# Altium project PCB_Project.PrjPcb
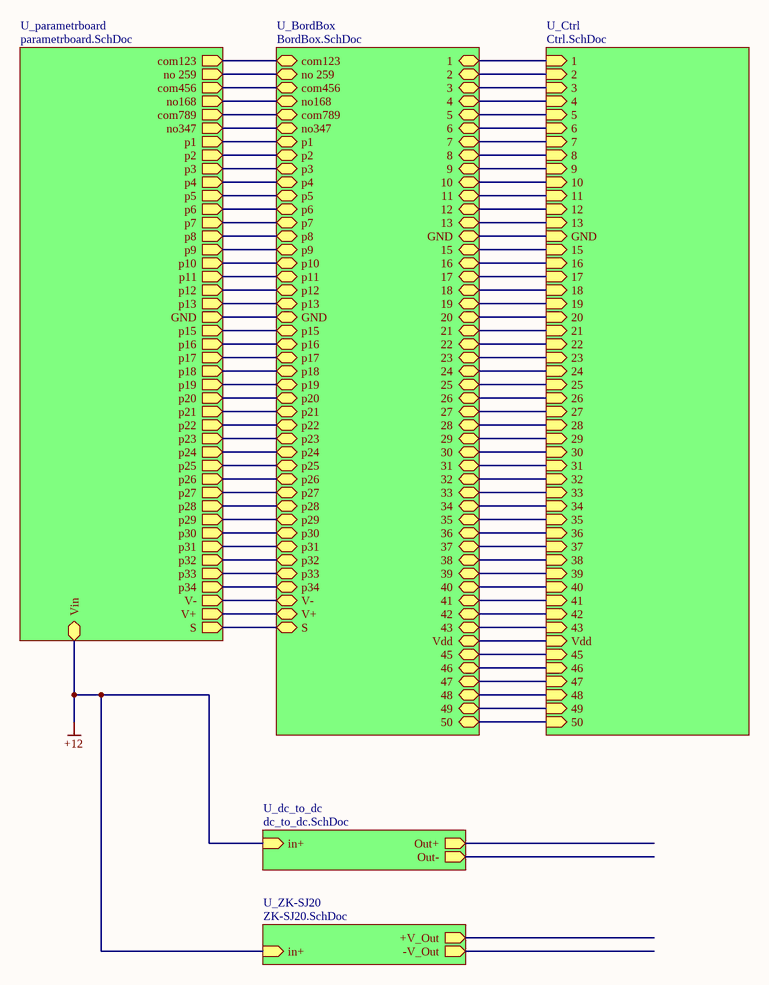
[diagram p0: finetunebox.SchDoc]
6 sheets, 29 parts. Net scope: hierarchical (ports join the sheet entries above them; power ports are global).
Board files: Ctrl.PcbDoc, BoardBox.PcbDoc
Sheets:
  finetunebox.SchDoc
    U_parametrboard = parametrboard.SchDoc
    U_BordBox = BordBox.SchDoc
    U_Ctrl = Ctrl.SchDoc
    U_ZK-SJ20 = ZK-SJ20.SchDoc
    U_dc_to_dc = dc_to_dc.SchDoc

## Sheet finetunebox.SchDoc
size A; SheetNumber: 1; SheetTotal: 6

### Sub-sheets
U_BordBox = BordBox.SchDoc: com123 (bidir), no 259 (bidir), com456 (bidir), no168 (bidir), com789 (bidir), no347 (bidir), p1 (bidir), p2 (bidir), p3 (bidir), p4 (bidir), p5 (bidir), p6 (bidir), p7 (bidir), p8 (bidir), p9 (bidir), p34 (bidir), p33 (bidir), p32 (bidir), p31 (bidir), p30 (bidir), p29 (bidir), p28 (bidir), p27 (bidir), p26 (bidir), p25 (bidir), p24 (bidir), p23 (bidir), p22 (bidir), p21 (bidir), p20 (bidir), p19 (bidir), p18 (bidir), V- (bidir), V+ (bidir), S (bidir), p10 (bidir), p11 (bidir), p12 (bidir), p13 (bidir), p15 (bidir), p16 (bidir), p17 (bidir), 2 (bidir), 1 (bidir), 3 (bidir), 4 (bidir), 5 (bidir), 6 (bidir), 7 (bidir), 8 (bidir), 9 (bidir), 10 (bidir), 11 (bidir), 12 (bidir), 13 (bidir), 15 (bidir), 16 (bidir), 17 (bidir), 18 (bidir), 19 (bidir), 20 (bidir), 21 (bidir), 22 (bidir), 23 (bidir), 24 (bidir), 25 (bidir), 26 (bidir), 27 (bidir), 28 (bidir), 29 (bidir), 30 (bidir), 31 (bidir), 32 (bidir), 33 (bidir), 34 (bidir), 35 (bidir), 36 (bidir), 37 (bidir), 38 (bidir), 39 (bidir), 40 (bidir), 41 (bidir), 42 (bidir), 43 (bidir), 46 (bidir), 47 (bidir), 48 (bidir), 49 (bidir), 50 (bidir), Vdd (bidir), GND (bidir), 45 (bidir), GND (bidir)
U_Ctrl = Ctrl.SchDoc: 1 (in), 2 (in), 3 (in), 4 (in), 5 (in), 6 (in), 7 (in), 8 (in), 9 (in), 10 (in), 11 (in), 12 (in), 13 (in), 15 (in), 16 (in), 17 (in), 18 (in), 19 (in), 20 (in), 21 (in), 22 (in), 23 (in), 24 (in), 25 (in), 26 (in), 27 (in), 28 (in), 29 (in), 30 (in), 31 (in), 32 (in), 33 (in), 34 (in), 46 (in), 47 (in), 48 (in), 49 (in), 50 (in), 35 (in), 36 (in), 37 (in), 38 (in), 39 (in), 40 (in), 41 (in), 42 (in), 43 (in), Vdd (in), GND (in), 45 (in)
U_dc_to_dc = dc_to_dc.SchDoc: in+ (in), Out+ (out), Out- (out)
U_parametrboard = parametrboard.SchDoc: com123 (out), no 259 (out), com456 (out), no168 (out), com789 (out), no347 (out), p1 (out), p2 (out), p3 (out), p4 (out), p5 (out), p6 (out), p7 (out), p8 (out), p9 (out), p10 (out), p11 (out), p12 (out), p13 (out), p15 (out), p16 (out), p17 (out), p34 (out), p33 (out), p32 (out), p31 (out), p30 (out), p29 (out), p28 (out), p27 (out), p26 (out), p25 (out), p24 (out), p23 (out), p22 (out), p21 (out), p20 (out), p19 (out), p18 (out), V- (out), V+ (out), S (out), Vin (bidir), GND (out)
U_ZK-SJ20 = ZK-SJ20.SchDoc: +V_Out (out), -V_Out (out), in+ (in)

### Nets
+12: sheet U_parametrboard/Vin, sheet U_ZK-SJ20/in+, sheet U_dc_to_dc/in+
1: sheet U_parametrboard/p1, sheet U_BordBox/p1, sheet U_BordBox/1, sheet U_Ctrl/1
2: sheet U_parametrboard/p2, sheet U_BordBox/p2, sheet U_BordBox/2, sheet U_Ctrl/2
3: sheet U_parametrboard/p3, sheet U_BordBox/p3, sheet U_BordBox/3, sheet U_Ctrl/3
4: sheet U_parametrboard/p4, sheet U_BordBox/p4, sheet U_BordBox/4, sheet U_Ctrl/4
5: sheet U_parametrboard/p5, sheet U_BordBox/p5, sheet U_BordBox/5, sheet U_Ctrl/5
6: sheet U_parametrboard/p6, sheet U_BordBox/p6, sheet U_BordBox/6, sheet U_Ctrl/6
7: sheet U_parametrboard/p7, sheet U_BordBox/p7, sheet U_BordBox/7, sheet U_Ctrl/7
8: sheet U_parametrboard/p8, sheet U_BordBox/p8, sheet U_BordBox/8, sheet U_Ctrl/8
9: sheet U_parametrboard/p9, sheet U_BordBox/p9, sheet U_BordBox/9, sheet U_Ctrl/9
10: sheet U_parametrboard/p10, sheet U_BordBox/p10, sheet U_BordBox/10, sheet U_Ctrl/10
11: sheet U_parametrboard/p11, sheet U_BordBox/p11, sheet U_BordBox/11, sheet U_Ctrl/11
12: sheet U_parametrboard/p12, sheet U_BordBox/p12, sheet U_BordBox/12, sheet U_Ctrl/12
13: sheet U_parametrboard/p13, sheet U_BordBox/p13, sheet U_BordBox/13, sheet U_Ctrl/13
15: sheet U_parametrboard/p15, sheet U_BordBox/p15, sheet U_BordBox/15, sheet U_Ctrl/15
16: sheet U_parametrboard/p16, sheet U_BordBox/p16, sheet U_BordBox/16, sheet U_Ctrl/16
17: sheet U_parametrboard/p17, sheet U_BordBox/p17, sheet U_BordBox/17, sheet U_Ctrl/17
18: sheet U_parametrboard/p18, sheet U_BordBox/p18, sheet U_BordBox/18, sheet U_Ctrl/18
19: sheet U_parametrboard/p19, sheet U_BordBox/p19, sheet U_BordBox/19, sheet U_Ctrl/19
20: sheet U_parametrboard/p20, sheet U_BordBox/p20, sheet U_BordBox/20, sheet U_Ctrl/20
21: sheet U_parametrboard/p21, sheet U_BordBox/p21, sheet U_BordBox/21, sheet U_Ctrl/21
22: sheet U_parametrboard/p22, sheet U_BordBox/p22, sheet U_BordBox/22, sheet U_Ctrl/22
23: sheet U_parametrboard/p23, sheet U_BordBox/p23, sheet U_BordBox/23, sheet U_Ctrl/23
24: sheet U_parametrboard/p24, sheet U_BordBox/p24, sheet U_BordBox/24, sheet U_Ctrl/24
25: sheet U_parametrboard/p25, sheet U_BordBox/p25, sheet U_BordBox/25, sheet U_Ctrl/25
26: sheet U_parametrboard/p26, sheet U_BordBox/p26, sheet U_BordBox/26, sheet U_Ctrl/26
27: sheet U_parametrboard/p27, sheet U_BordBox/p27, sheet U_BordBox/27, sheet U_Ctrl/27
28: sheet U_parametrboard/p28, sheet U_BordBox/p28, sheet U_BordBox/28, sheet U_Ctrl/28
29: sheet U_parametrboard/p29, sheet U_BordBox/p29, sheet U_BordBox/29, sheet U_Ctrl/29
30: sheet U_parametrboard/p30, sheet U_BordBox/p30, sheet U_BordBox/30, sheet U_Ctrl/30
31: sheet U_parametrboard/p31, sheet U_BordBox/p31, sheet U_BordBox/31, sheet U_Ctrl/31
32: sheet U_parametrboard/p32, sheet U_BordBox/p32, sheet U_BordBox/32, sheet U_Ctrl/32
33: sheet U_parametrboard/p33, sheet U_BordBox/p33, sheet U_BordBox/33, sheet U_Ctrl/33
34: sheet U_parametrboard/p34, sheet U_BordBox/p34, sheet U_BordBox/34, sheet U_Ctrl/34
35: sheet U_parametrboard/no347, sheet U_BordBox/no347, sheet U_BordBox/35, sheet U_Ctrl/35
36: sheet U_parametrboard/com789, sheet U_BordBox/com789, sheet U_BordBox/36, sheet U_Ctrl/36
37: sheet U_parametrboard/no168, sheet U_BordBox/no168, sheet U_BordBox/37, sheet U_Ctrl/37
38: sheet U_parametrboard/com456, sheet U_BordBox/com456, sheet U_BordBox/38, sheet U_Ctrl/38
39: sheet U_parametrboard/no 259, sheet U_BordBox/no 259, sheet U_BordBox/39, sheet U_Ctrl/39
40: sheet U_parametrboard/com123, sheet U_BordBox/com123, sheet U_BordBox/40, sheet U_Ctrl/40
41: sheet U_parametrboard/S, sheet U_BordBox/S, sheet U_BordBox/41, sheet U_Ctrl/41
42: sheet U_parametrboard/V+, sheet U_BordBox/V+, sheet U_BordBox/42, sheet U_Ctrl/42
43: sheet U_parametrboard/V-, sheet U_BordBox/V-, sheet U_BordBox/43, sheet U_Ctrl/43
45: sheet U_BordBox/45, sheet U_Ctrl/45
46: sheet U_BordBox/46, sheet U_Ctrl/46
47: sheet U_BordBox/47, sheet U_Ctrl/47
48: sheet U_BordBox/48, sheet U_Ctrl/48
49: sheet U_BordBox/49, sheet U_Ctrl/49
50: sheet U_BordBox/50, sheet U_Ctrl/50
GND: sheet U_parametrboard/GND, sheet U_BordBox/GND, sheet U_BordBox/GND, sheet U_Ctrl/GND
Vdd: sheet U_BordBox/Vdd, sheet U_Ctrl/Vdd

## Sheet parametrboard.SchDoc
size A; SheetNumber: 2; SheetTotal: 6
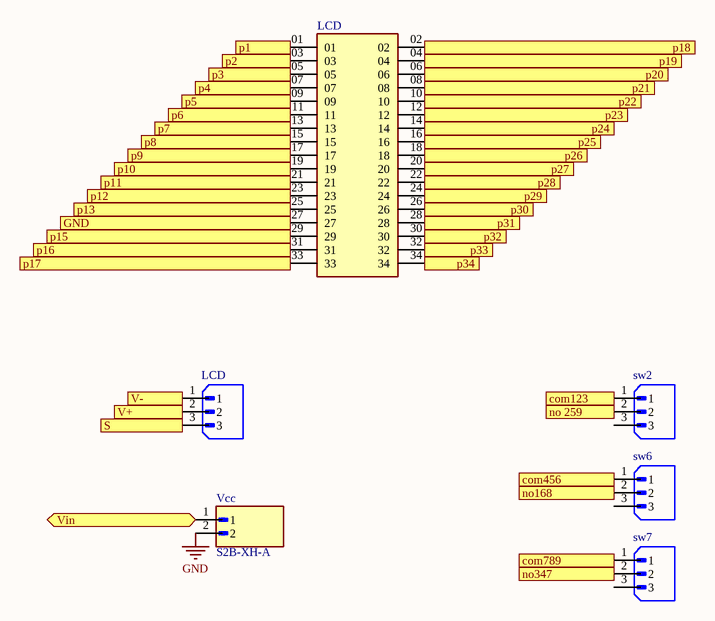
[diagram p1: parametrboard.SchDoc]

### Parts
(Parts that share a designator on the sheet are numbered #1, #2 ... from top to bottom, then left to right.)
LCD#1  TSW-117-23-G-D  [SAMTEC_TSW-117-23-G-D]  (value not drawn)
LCD#2  TSW-117-23-G-D  [SAMTEC_TSW-117-23-G-D]  (value not drawn)
sw2#1  B3B-XH-A  [JST_B3B-XH-A]  (value not drawn)
sw6#1  B3B-XH-A  [JST_B3B-XH-A]  (value not drawn)
sw7#1  B3B-XH-A  [JST_B3B-XH-A]  (value not drawn)
Vcc  S2B-XH-A  [JST_S2B-XH-A]

### Ports
com123 (out, see finetunebox[1A], BordBox[2C]), com456 (out, see finetunebox[1A], BordBox[3C]), com789 (out, see finetunebox[1A], BordBox[4C]), GND (out, see finetunebox[1B], BordBox[1B], BordBox[4B], Ctrl[4A]), no168 (out, see finetunebox[1A], BordBox[3C]), no347 (out, see finetunebox[1A], BordBox[4C]), no 259 (out, see finetunebox[1A], BordBox[2C]), p1 (out, see finetunebox[1A], BordBox[1A]), p2 (out, see finetunebox[1A], BordBox[1A]), p3 (out, see finetunebox[1A], BordBox[1A]), p4 (out, see finetunebox[1A], BordBox[1A]), p5 (out, see finetunebox[1A], BordBox[1A]), p6 (out, see finetunebox[1A], BordBox[1A]), p7 (out, see finetunebox[1A], BordBox[1A]), p8 (out, see finetunebox[1B], BordBox[1A]), p9 (out, see finetunebox[1B], BordBox[1A]), p10 (out, see finetunebox[1B], BordBox[1A]), p11 (out, see finetunebox[1B], BordBox[1B]), p12 (out, see finetunebox[1B], BordBox[1B]), p13 (out, see finetunebox[1B], BordBox[1B]), p15 (out, see finetunebox[1B], BordBox[1B]), p16 (out, see finetunebox[1B], BordBox[1B]), p17 (out, see finetunebox[1B], BordBox[1B]), p18 (out, see finetunebox[1B], BordBox[2A]), p19 (out, see finetunebox[1B], BordBox[2A]), p20 (out, see finetunebox[1B], BordBox[2A]), p21 (out, see finetunebox[1B], BordBox[2A]), p22 (out, see finetunebox[1B], BordBox[2A]), p23 (out, see finetunebox[1B], BordBox[2A]), p24 (out, see finetunebox[1B], BordBox[2A]), p25 (out, see finetunebox[1B], BordBox[2A]), p26 (out, see finetunebox[1B], BordBox[2A]), p27 (out, see finetunebox[1C], BordBox[2A]), p28 (out, see finetunebox[1C], BordBox[2B]), p29 (out, see finetunebox[1C], BordBox[2B]), p30 (out, see finetunebox[1C], BordBox[2B]), p31 (out, see finetunebox[1C], BordBox[2B]), p32 (out, see finetunebox[1C], BordBox[2B]), p33 (out, see finetunebox[1C], BordBox[2B]), p34 (out, see finetunebox[1C], BordBox[2B]), S (out, see finetunebox[1C], BordBox[2D]), V+ (out, see finetunebox[1C], BordBox[2D]), V- (out, see finetunebox[1C], BordBox[2D]), Vin (bidir, see finetunebox[1C])

### Nets
+12: Vcc.1 ; port Vin
GND: Vcc.2
1: LCD#1.01 ; port p1
2: LCD#1.03 ; port p2
3: LCD#1.05 ; port p3
4: LCD#1.07 ; port p4
5: LCD#1.09 ; port p5
6: LCD#1.11 ; port p6
7: LCD#1.13 ; port p7
8: LCD#1.15 ; port p8
9: LCD#1.17 ; port p9
10: LCD#1.19 ; port p10
11: LCD#1.21 ; port p11
12: LCD#1.23 ; port p12
13: LCD#1.25 ; port p13
15: LCD#1.29 ; port p15
16: LCD#1.31 ; port p16
17: LCD#1.33 ; port p17
18: LCD#1.02 ; port p18
19: LCD#1.04 ; port p19
20: LCD#1.06 ; port p20
21: LCD#1.08 ; port p21
22: LCD#1.10 ; port p22
23: LCD#1.12 ; port p23
24: LCD#1.14 ; port p24
25: LCD#1.16 ; port p25
26: LCD#1.18 ; port p26
27: LCD#1.20 ; port p27
28: LCD#1.22 ; port p28
29: LCD#1.24 ; port p29
30: LCD#1.26 ; port p30
31: LCD#1.28 ; port p31
32: LCD#1.30 ; port p32
33: LCD#1.32 ; port p33
34: LCD#1.34 ; port p34
35: sw7#1.2 ; port no347
36: sw7#1.1 ; port com789
37: sw6#1.2 ; port no168
38: sw6#1.1 ; port com456
39: sw2#1.2 ; port no 259
40: sw2#1.1 ; port com123
41: LCD#2.3 ; port S
42: LCD#2.2 ; port V+
43: LCD#2.1 ; port V-
GND: LCD#1.27 ; port GND  [a separate net that carries the same name]

Not connected (* = marked no-connect by the designer): sw2#1 3; sw6#1 3; sw7#1 3

### Library data of the parts
LCD#2 sw2#1 sw6#1 sw7#1 = B3B-XH-A: Connector Header Through Hole 3 position 0.098 (2.50mm); MF: JST Sales; SnapEDA_Link: https://www.snapeda.com/parts/B3B-XH-A/JST+Sales+America+Inc./view-part/?ref=snap; Package: None; Value: *; MP: B3B-XH-A; Check_prices: https://www.snapeda.com/parts/B3B-XH-A/JST+Sales+America+Inc./view-part/?ref=eda
LCD#1 = TSW-117-23-G-D: Package: None; Price: None; Value: *; MP: TSW-117-23-G-D; Availability: Unavailable
Vcc = S2B-XH-A: Package: None; Price: None; Value: *; MP: S2B-XH-A; Availability: Unavailable

## Sheet BordBox.SchDoc
size A; SheetNumber: 5; SheetTotal: 6
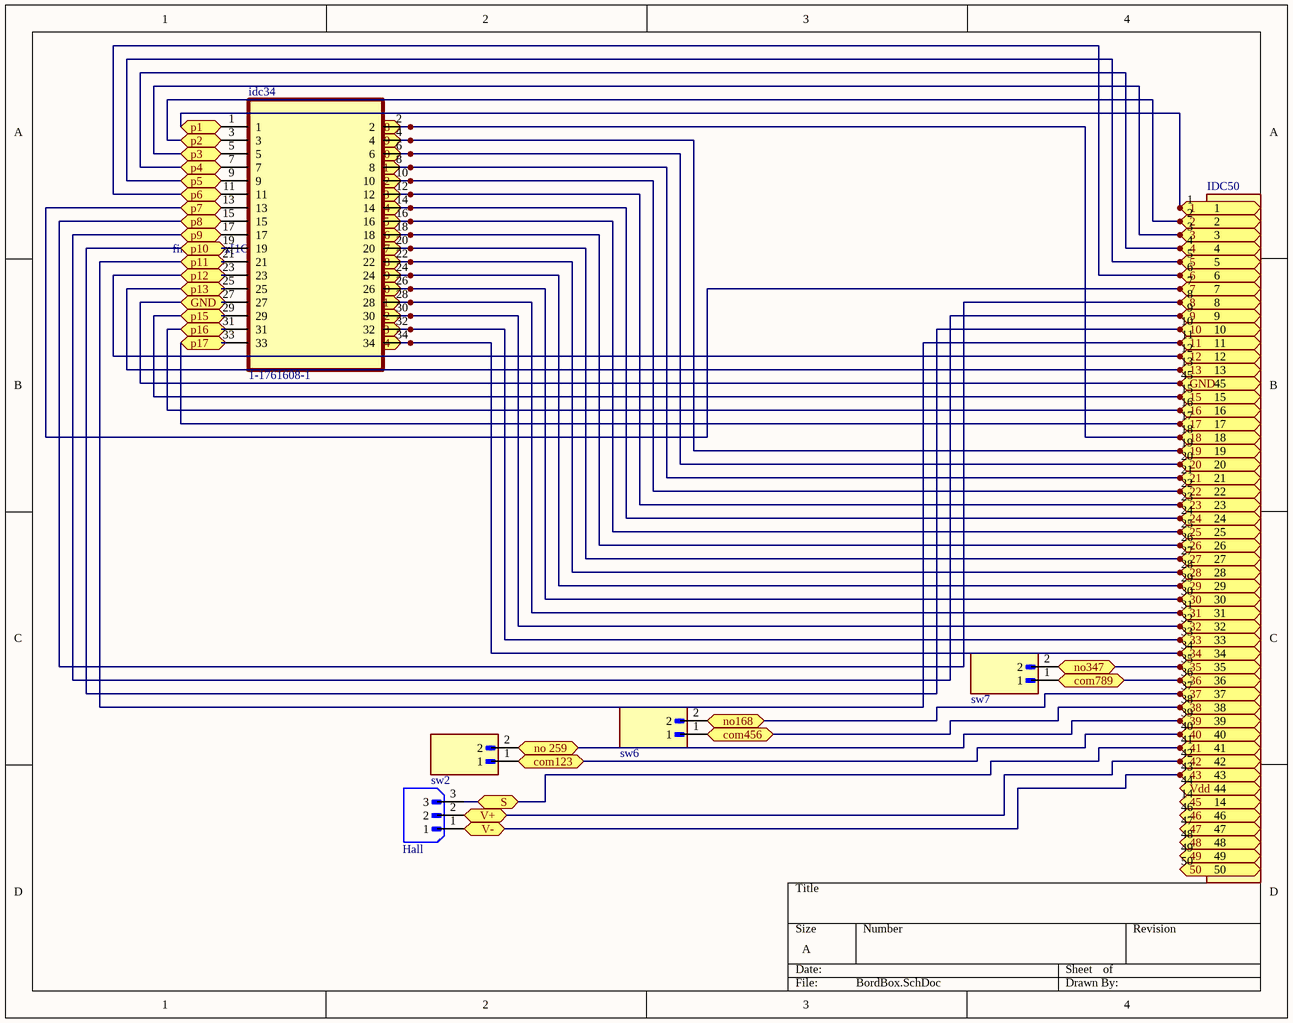
[diagram p2: BordBox.SchDoc]

### Parts
(Parts that share a designator on the sheet are numbered #1, #2 ... from top to bottom, then left to right.)
Hall  B3B-XH-A  [JST_B3B-XH-A]  (value not drawn)
idc34  1-1761608-1  [TYCO_1-1761608-1]
IDC50  1-1761686-5  [TE_1-1761686-5]  (value not drawn)
sw2#2  S2B-XH-A  [JST_S2B-XH-A]  (value not drawn)
sw6#2  S2B-XH-A  [JST_S2B-XH-A]  (value not drawn)
sw7#2  S2B-XH-A  [JST_S2B-XH-A]  (value not drawn)

### Ports
1 (bidir, see finetunebox[2A], Ctrl[4A]), 2 (bidir, see finetunebox[2A], Ctrl[4A]), 3 (bidir, see finetunebox[2A], Ctrl[4A]), 4 (bidir, see finetunebox[2A], Ctrl[4A]), 5 (bidir, see finetunebox[2A], Ctrl[4A]), 6 (bidir, see finetunebox[2A], Ctrl[4A]), 7 (bidir, see finetunebox[2A], Ctrl[4A]), 8 (bidir, see finetunebox[2A], Ctrl[4A]), 9 (bidir, see finetunebox[2A], Ctrl[4A]), 10 (bidir, see finetunebox[2A], Ctrl[4A]), 11 (bidir, see finetunebox[2A], Ctrl[4A]), 12 (bidir, see finetunebox[2A], Ctrl[4A]), 13 (bidir, see finetunebox[2A], Ctrl[4A]), 15 (bidir, see finetunebox[2B], Ctrl[4A]), 16 (bidir, see finetunebox[2B], Ctrl[4A]), 17 (bidir, see finetunebox[2B], Ctrl[4B]), 18 (bidir, see finetunebox[2B], Ctrl[4B]), 19 (bidir, see finetunebox[2B], Ctrl[4B]), 20 (bidir, see finetunebox[2B], Ctrl[4B]), 21 (bidir, see finetunebox[2B], Ctrl[4B]), 22 (bidir, see finetunebox[2B], Ctrl[4B]), 23 (bidir, see finetunebox[2B], Ctrl[4B]), 24 (bidir, see finetunebox[2B], Ctrl[4B]), 25 (bidir, see finetunebox[2B], Ctrl[4B]), 26 (bidir, see finetunebox[2B], Ctrl[4B]), 27 (bidir, see finetunebox[2B], Ctrl[4B]), 28 (bidir, see finetunebox[2B], Ctrl[4B]), 29 (bidir, see finetunebox[2B], Ctrl[4B]), 30 (bidir, see finetunebox[2B], Ctrl[4B]), 31 (bidir, see finetunebox[2B], Ctrl[4B]), 32 (bidir, see finetunebox[2B], Ctrl[4B]), 33 (bidir, see finetunebox[2C], Ctrl[4B]), 34 (bidir, see finetunebox[2C], Ctrl[4B]), 35 (bidir, see finetunebox[2C], Ctrl[3B]), 36 (bidir, see finetunebox[2C], Ctrl[3B]), 37 (bidir, see finetunebox[2C], Ctrl[2B]), 38 (bidir, see finetunebox[2C], Ctrl[2B]), 39 (bidir, see finetunebox[2C], Ctrl[2B]), 40 (bidir, see finetunebox[2C], Ctrl[2C]), 41 (bidir, see finetunebox[2C], Ctrl[2C]), 42 (bidir, see finetunebox[2C], Ctrl[2C]), 43 (bidir, see finetunebox[2C], Ctrl[2D]), 45 (bidir, see finetunebox[2C], Ctrl[3C]), 46 (bidir, see finetunebox[2C], Ctrl[3C]), 47 (bidir, see finetunebox[2C], Ctrl[3C]), 48 (bidir, see finetunebox[2C], Ctrl[3C]), 49 (bidir, see finetunebox[2C], Ctrl[3C]), 50 (bidir, see finetunebox[2C], Ctrl[3C]), com123 (bidir, see finetunebox[1A], parametrboard[3B]), com456 (bidir, see finetunebox[1A], parametrboard[2C]), com789 (bidir, see finetunebox[1A], parametrboard[2C]), GND (bidir, see finetunebox[1B], Ctrl[4A], parametrboard[1B]), no168 (bidir, see finetunebox[1A], parametrboard[2C]), no347 (bidir, see finetunebox[1A], parametrboard[2C]), no 259 (bidir, see finetunebox[1A], parametrboard[3B]), p1 (bidir, see finetunebox[1A], parametrboard[2A]), p2 (bidir, see finetunebox[1A], parametrboard[2A]), p3 (bidir, see finetunebox[1A], parametrboard[2A]), p4 (bidir, see finetunebox[1A], parametrboard[1A]), p5 (bidir, see finetunebox[1A], parametrboard[1A]), p6 (bidir, see finetunebox[1A], parametrboard[1A]), p7 (bidir, see finetunebox[1A], parametrboard[1A]), p8 (bidir, see finetunebox[1B], parametrboard[1A]), p9 (bidir, see finetunebox[1B], parametrboard[1A]), p10 (bidir, see finetunebox[1B], parametrboard[1A]), p11 (bidir, see finetunebox[1B], parametrboard[1A]), p12 (bidir, see finetunebox[1B], parametrboard[1A]), p13 (bidir, see finetunebox[1B], parametrboard[1A]), p15 (bidir, see finetunebox[1B], parametrboard[1B]), p16 (bidir, see finetunebox[1B], parametrboard[1B]), p17 (bidir, see finetunebox[1B], parametrboard[1B]), p18 (bidir, see finetunebox[1B], parametrboard[2A]), p19 (bidir, see finetunebox[1B], parametrboard[2A]), p20 (bidir, see finetunebox[1B], parametrboard[2A]), p21 (bidir, see finetunebox[1B], parametrboard[2A]), p22 (bidir, see finetunebox[1B], parametrboard[2A]), p23 (bidir, see finetunebox[1B], parametrboard[2A]), p24 (bidir, see finetunebox[1B], parametrboard[2A]), p25 (bidir, see finetunebox[1B], parametrboard[2A]), p26 (bidir, see finetunebox[1B], parametrboard[2A]), p27 (bidir, see finetunebox[1C], parametrboard[2A]), p28 (bidir, see finetunebox[1C], parametrboard[2A]), p29 (bidir, see finetunebox[1C], parametrboard[2A]), p30 (bidir, see finetunebox[1C], parametrboard[2A]), p31 (bidir, see finetunebox[1C], parametrboard[2B]), p32 (bidir, see finetunebox[1C], parametrboard[2B]), p33 (bidir, see finetunebox[1C], parametrboard[2B]), p34 (bidir, see finetunebox[1C], parametrboard[2B]), S (bidir, see finetunebox[1C], parametrboard[1B]), V+ (bidir, see finetunebox[1C], parametrboard[1B]), V- (bidir, see finetunebox[1C], parametrboard[1B]), Vdd (bidir, see finetunebox[2C], Ctrl[3C])

### Nets
1: idc34.1 IDC50.1 ; port p1, port 1
2: idc34.3 IDC50.2 ; port p2, port 2
3: idc34.5 IDC50.3 ; port p3, port 3
4: idc34.7 IDC50.4 ; port p4, port 4
5: idc34.9 IDC50.5 ; port p5, port 5
6: idc34.11 IDC50.6 ; port p6, port 6
7: idc34.13 IDC50.7 ; port p7, port 7
8: idc34.15 IDC50.8 ; port p8, port 8
9: idc34.17 IDC50.9 ; port p9, port 9
10: idc34.19 IDC50.10 ; port p10, port 10
11: idc34.21 IDC50.11 ; port p11, port 11
12: idc34.23 IDC50.12 ; port p12, port 12
13: idc34.25 IDC50.13 ; port p13, port 13
15: idc34.29 IDC50.15 ; port p15, port 15
16: idc34.31 IDC50.16 ; port p16, port 16
17: idc34.33 IDC50.17 ; port p17, port 17
18: idc34.2 IDC50.18 ; port p18, port 18
19: idc34.4 IDC50.19 ; port p19, port 19
20: idc34.6 IDC50.20 ; port p20, port 20
21: idc34.8 IDC50.21 ; port p21, port 21
22: idc34.10 IDC50.22 ; port p22, port 22
23: idc34.12 IDC50.23 ; port p23, port 23
24: idc34.14 IDC50.24 ; port p24, port 24
25: idc34.16 IDC50.25 ; port p25, port 25
26: idc34.18 IDC50.26 ; port p26, port 26
27: idc34.20 IDC50.27 ; port p27, port 27
28: idc34.22 IDC50.28 ; port p28, port 28
29: idc34.24 IDC50.29 ; port p29, port 29
30: idc34.26 IDC50.30 ; port p30, port 30
31: idc34.28 IDC50.31 ; port p31, port 31
32: idc34.30 IDC50.32 ; port p32, port 32
33: idc34.32 IDC50.33 ; port p33, port 33
34: idc34.34 IDC50.34 ; port p34, port 34
35: IDC50.35 sw7#2.2 ; port no347, port 35
36: IDC50.36 sw7#2.1 ; port com789, port 36
37: IDC50.37 sw6#2.2 ; port no168, port 37
38: IDC50.38 sw6#2.1 ; port com456, port 38
39: IDC50.39 sw2#2.2 ; port no 259, port 39
40: IDC50.40 sw2#2.1 ; port com123, port 40
41: Hall.3 IDC50.41 ; port S, port 41
42: Hall.2 IDC50.42 ; port V+, port 42
43: Hall.1 IDC50.43 ; port V-, port 43
45: IDC50.14 ; port 45
46: IDC50.46 ; port 46
47: IDC50.47 ; port 47
48: IDC50.48 ; port 48
49: IDC50.49 ; port 49
50: IDC50.50 ; port 50
GND: idc34.27 IDC50.45 ; port GND
Vdd: IDC50.44 ; port Vdd

### Library data of the parts
Hall = B3B-XH-A: as LCD#2 on sheet parametrboard; SnapEDA_Link: https://www.snapeda.com/parts/B3B-XH-A/JST+Sales+America+Inc./view-part/?ref=snap; Package: None; Value: *; MP: B3B-XH-A; Check_prices: https://www.snapeda.com/parts/B3B-XH-A/JST+Sales+America+Inc./view-part/?ref=eda
idc34 = 1-1761608-1: IDC LOW PRO HDR 34P VERT SHT L; MF: TE Connectivity; MP: 117616081; SnapEDA_Link: https://www.snapeda.com/parts/117616081/TE+Connectivity/view-part/?ref=snap; Package: None; Value: *; Check_prices: https://www.snapeda.com/parts/117616081/TE+Connectivity/view-part/?ref=eda
IDC50 = 1-1761686-5: Package: None; Price: None; Value: *; MP: 1-1761686-5; Availability: Unavailable
sw2#2 sw6#2 sw7#2 = S2B-XH-A: Package: None; Price: None; Value: *; MP: S2B-XH-A; Availability: Unavailable

## Sheet Ctrl.SchDoc
size A; SheetNumber: 4; SheetTotal: 6
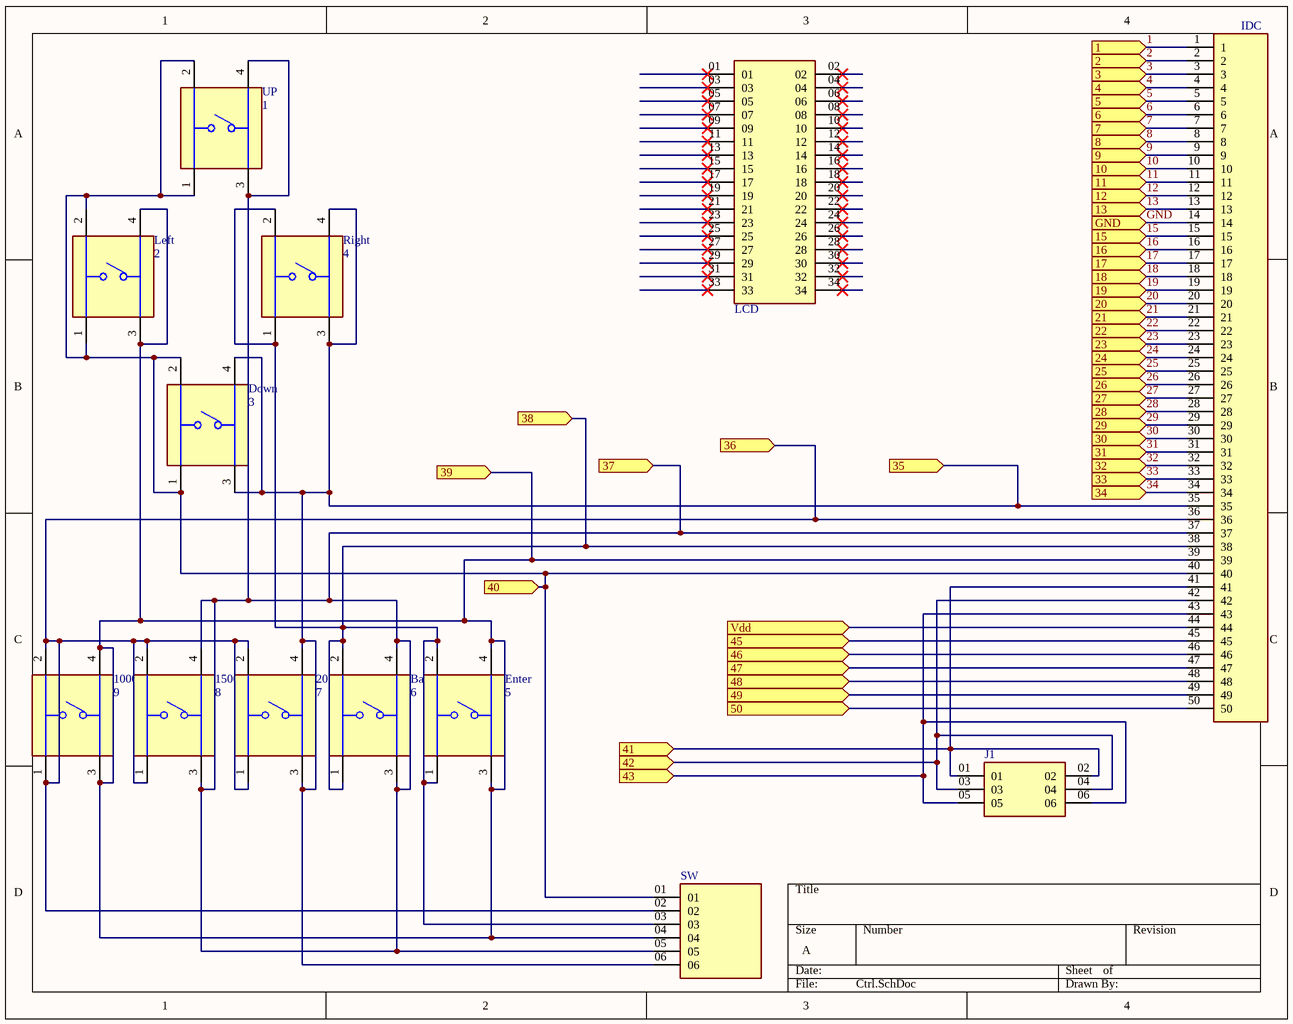
[diagram p3: Ctrl.SchDoc]

### Parts
(Parts that share a designator on the sheet are numbered #1, #2 ... from top to bottom, then left to right.)
1000  9  [SW_TS01-66-73-BK-100-D]
1500  8  [SW_TS01-66-73-BK-100-D]
2000  7  [SW_TS01-66-73-BK-100-D]
Back  6  [SW_TS01-66-73-BK-100-D]
Down  3  [SW_TS01-66-73-BK-100-D]
Enter  5  [SW_TS01-66-73-BK-100-D]
IDC#1  1-1761686-5  [TE_1-1761686-5]  (value not drawn)
J1  MTLW-103-07-L-D-320  [SAMTEC_MTLW-103-07-L-D-320]  (value not drawn)
LCD#3  TSW-117-23-G-D  [SAMTEC_TSW-117-23-G-D]  (value not drawn)
Left  2  [SW_TS01-66-73-BK-100-D]
Right  4  [SW_TS01-66-73-BK-100-D]
SW  MTLW-106-05-T-S-137  [SAMTEC_MTLW-106-05-T-S-137]  (value not drawn)
UP  1  [SW_TS01-66-73-BK-100-D]

### Ports
1 (in, see finetunebox[2A], BordBox[4A]), 2 (in, see finetunebox[2A], BordBox[4A]), 3 (in, see finetunebox[2A], BordBox[4A]), 4 (in, see finetunebox[2A], BordBox[4A]), 5 (in, see finetunebox[2A], BordBox[4B]), 6 (in, see finetunebox[2A], BordBox[4B]), 7 (in, see finetunebox[2A], BordBox[4B]), 8 (in, see finetunebox[2A], BordBox[4B]), 9 (in, see finetunebox[2A], BordBox[4B]), 10 (in, see finetunebox[2A], BordBox[4B]), 11 (in, see finetunebox[2A], BordBox[4B]), 12 (in, see finetunebox[2A], BordBox[4B]), 13 (in, see finetunebox[2A], BordBox[4B]), 15 (in, see finetunebox[2B], BordBox[4B]), 16 (in, see finetunebox[2B], BordBox[4B]), 17 (in, see finetunebox[2B], BordBox[4B]), 18 (in, see finetunebox[2B], BordBox[4B]), 19 (in, see finetunebox[2B], BordBox[4B]), 20 (in, see finetunebox[2B], BordBox[4B]), 21 (in, see finetunebox[2B], BordBox[4B]), 22 (in, see finetunebox[2B], BordBox[4B]), 23 (in, see finetunebox[2B], BordBox[4B]), 24 (in, see finetunebox[2B], BordBox[4C]), 25 (in, see finetunebox[2B], BordBox[4C]), 26 (in, see finetunebox[2B], BordBox[4C]), 27 (in, see finetunebox[2B], BordBox[4C]), 28 (in, see finetunebox[2B], BordBox[4C]), 29 (in, see finetunebox[2B], BordBox[4C]), 30 (in, see finetunebox[2B], BordBox[4C]), 31 (in, see finetunebox[2B], BordBox[4C]), 32 (in, see finetunebox[2B], BordBox[4C]), 33 (in, see finetunebox[2C], BordBox[4C]), 34 (in, see finetunebox[2C], BordBox[4C]), 35 (in, see finetunebox[2C], BordBox[4C]), 36 (in, see finetunebox[2C], BordBox[4C]), 37 (in, see finetunebox[2C], BordBox[4C]), 38 (in, see finetunebox[2C], BordBox[4C]), 39 (in, see finetunebox[2C], BordBox[4C]), 40 (in, see finetunebox[2C], BordBox[4C]), 41 (in, see finetunebox[2C], BordBox[4C]), 42 (in, see finetunebox[2C], BordBox[4C]), 43 (in, see finetunebox[2C], BordBox[4D]), 45 (in, see finetunebox[2C], BordBox[4D]), 46 (in, see finetunebox[2C], BordBox[4D]), 47 (in, see finetunebox[2C], BordBox[4D]), 48 (in, see finetunebox[2C], BordBox[4D]), 49 (in, see finetunebox[2C], BordBox[4D]), 50 (in, see finetunebox[2C], BordBox[4D]), GND (in, see finetunebox[2B], BordBox[1B], BordBox[4B], parametrboard[1B]), Vdd (in, see finetunebox[2C], BordBox[4D])

### Nets
1: IDC#1.1 ; port 1
2: IDC#1.2 ; port 2
3: IDC#1.3 ; port 3
4: IDC#1.4 ; port 4
5: IDC#1.5 ; port 5
6: IDC#1.6 ; port 6
7: IDC#1.7 ; port 7
8: IDC#1.8 ; port 8
9: IDC#1.9 ; port 9
10: IDC#1.10 ; port 10
11: IDC#1.11 ; port 11
12: IDC#1.12 ; port 12
13: IDC#1.13 ; port 13
15: IDC#1.15 ; port 15
16: IDC#1.16 ; port 16
17: IDC#1.17 ; port 17
18: IDC#1.18 ; port 18
19: IDC#1.19 ; port 19
20: IDC#1.20 ; port 20
21: IDC#1.21 ; port 21
22: IDC#1.22 ; port 22
23: IDC#1.23 ; port 23
24: IDC#1.24 ; port 24
25: IDC#1.25 ; port 25
26: IDC#1.26 ; port 26
27: IDC#1.27 ; port 27
28: IDC#1.28 ; port 28
29: IDC#1.29 ; port 29
30: IDC#1.30 ; port 30
31: IDC#1.31 ; port 31
32: IDC#1.32 ; port 32
33: IDC#1.33 ; port 33
34: IDC#1.34 ; port 34
35: 2000.3 2000.4 Down.3 Down.4 IDC#1.35 Right.3 Right.4 SW.06 ; port 35
36: 1000.1 1000.2 1500.1 1500.2 2000.1 2000.2 IDC#1.36 SW.02 ; port 36
37: 1500.3 1500.4 Back.3 Back.4 IDC#1.37 SW.05 UP.3 UP.4 ; port 37
38: Back.1 Back.2 Enter.1 Enter.2 IDC#1.38 Right.1 Right.2 SW.03 ; port 38
39: 1000.3 1000.4 Enter.3 Enter.4 IDC#1.39 Left.3 Left.4 SW.04 ; port 39
40: Down.1 Down.2 IDC#1.40 Left.1 Left.2 SW.01 UP.1 UP.2 ; port 40
41: IDC#1.41 J1.01 J1.02 ; port 41
42: IDC#1.42 J1.03 J1.04 ; port 42
43: IDC#1.43 J1.05 J1.06 ; port 43
45: IDC#1.45 ; port 45
46: IDC#1.46 ; port 46
47: IDC#1.47 ; port 47
48: IDC#1.48 ; port 48
49: IDC#1.49 ; port 49
50: IDC#1.50 ; port 50
GND: IDC#1.14 ; port GND
Vdd: IDC#1.44 ; port Vdd

Not connected (* = marked no-connect by the designer): LCD#3 01* 02* 03* 04* 05* 06* 07* 08* 09* 10* 11* 12* 13* 14* 15* 16* 17* 18* 19* 20* 21* 22* 23* 24* 25* 26* 27* 28* 29* 30* 31* 32* 33* 34*

### Library data of the parts
1000 1500 2000 Back Down Enter Left Right UP = TS01-66-73-BK-100-D: 6 x 6 mm, 7.3 mm Actuator Height, 100 gf, Black, Long Crimped, Through Hole, SPST, Tactile Switch; MF: Same Sky; SnapEDA_Link: https://www.snapeda.com/parts/TS01-66-73-BK-100-D/Same+Sky/view-part/?ref=snap; Package: None; Value: *; MP: TS01-66-73-BK-100-D; Check_prices: https://www.snapeda.com/parts/TS01-66-73-BK-100-D/Same+Sky/view-part/?ref=eda
IDC#1 = 1-1761686-5: Package: None; Price: None; Value: *; MP: 1-1761686-5; Availability: Unavailable
J1 = MTLW-103-07-L-D-320: MP: MTLW-103-07-L-D-320; Package: None; Price: None; Availability: Unavailable; Value: *
LCD#3 = TSW-117-23-G-D: Package: None; Price: None; Value: *; MP: TSW-117-23-G-D; Availability: Unavailable
SW = MTLW-106-05-T-S-137: Value: *; Price: None; Package: None; Availability: Unavailable; MP: MTLW-106-05-T-S-137

## Sheet ZK-SJ20.SchDoc
size A; SheetNumber: 3; SheetTotal: 6
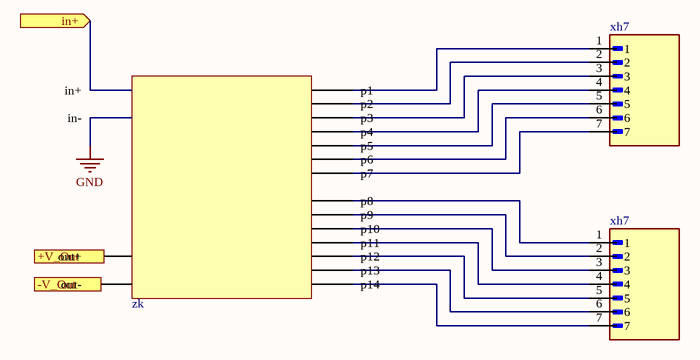
[diagram p4: ZK-SJ20.SchDoc]

### Parts
(Parts that share a designator on the sheet are numbered #1, #2 ... from top to bottom, then left to right.)
xh7#1  S7B-XH-A(LF)(SN)  [JST_S7B-XH-A(LF)(SN)]  (value not drawn)
xh7#2  S7B-XH-A(LF)(SN)  [JST_S7B-XH-A(LF)(SN)]  (value not drawn)
zk  zk  (value not drawn)

### Ports
+V_Out (out, see finetunebox[2D]), -V_Out (out, see finetunebox[2D]), in+ (in, see finetunebox[1D], dc_to_dc[2B])

### Nets
+12: zk.75(in+) ; port in+
GND: zk.76(in-)

Not connected (* = marked no-connect by the designer): xh7#1 1 2 3 4 5 6 7; xh7#2 1 2 3 4 5 6 7; zk 61(p1) 62(p2) 63(p3) 64(p4) 65(p5) 66(p6) 67(p7) 68(p14) 69(p13) 70(p12) 71(p11) 72(p10) 73(p9) 74(p8) 77(out+) 78(out-)

### Library data of the parts
xh7#1 xh7#2 = S7B-XH-A(LF)(SN): Connector Header Through Hole, Right Angle 7 position 0.098 (2.50mm); MF: JST Sales; SnapEDA_Link: https://www.snapeda.com/parts/S7B-XH-A(LF)(SN)/JST/view-part/?ref=snap; Package: None; Value: *; MP: S7B-XH-A(LF)(SN); Check_prices: https://www.snapeda.com/parts/S7B-XH-A(LF)(SN)/JST/view-part/?ref=eda

## Sheet dc_to_dc.SchDoc
size A; SheetNumber: 6; SheetTotal: 6
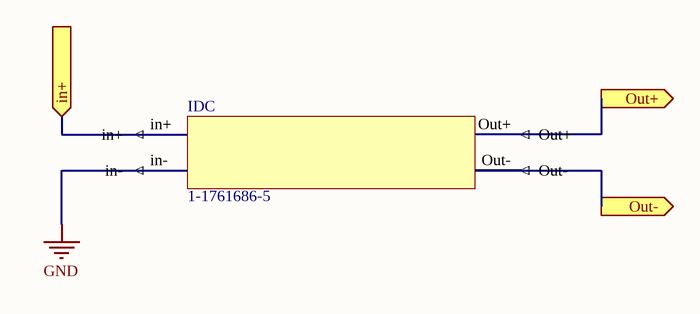
[diagram p5: dc_to_dc.SchDoc]

### Parts
(Parts that share a designator on the sheet are numbered #1, #2 ... from top to bottom, then left to right.)
IDC#2  1-1761686-5

### Ports
in+ (in, see finetunebox[1D], ZK-SJ20[1B]), Out+ (out, see finetunebox[2D]), Out- (out, see finetunebox[2D])

### Nets
+12: IDC#2.in+ ; port in+
GND: IDC#2.in-
Out+: IDC#2.Out+ ; port Out+
Out-: IDC#2.Out- ; port Out-

### Library data of the parts
IDC#2 = dc_dc

## Nets that join several sheets
+12: parametrboard (Vcc.1), ZK-SJ20 (zk.75), dc_to_dc (IDC#2.in+)
GND: parametrboard (Vcc.2), ZK-SJ20 (zk.76), dc_to_dc (IDC#2.in-)
1: parametrboard (LCD#1.01), BordBox (idc34.1 IDC50.1), Ctrl (IDC#1.1)
2: parametrboard (LCD#1.03), BordBox (idc34.3 IDC50.2), Ctrl (IDC#1.2)
3: parametrboard (LCD#1.05), BordBox (idc34.5 IDC50.3), Ctrl (IDC#1.3)
4: parametrboard (LCD#1.07), BordBox (idc34.7 IDC50.4), Ctrl (IDC#1.4)
5: parametrboard (LCD#1.09), BordBox (idc34.9 IDC50.5), Ctrl (IDC#1.5)
6: parametrboard (LCD#1.11), BordBox (idc34.11 IDC50.6), Ctrl (IDC#1.6)
7: parametrboard (LCD#1.13), BordBox (idc34.13 IDC50.7), Ctrl (IDC#1.7)
8: parametrboard (LCD#1.15), BordBox (idc34.15 IDC50.8), Ctrl (IDC#1.8)
9: parametrboard (LCD#1.17), BordBox (idc34.17 IDC50.9), Ctrl (IDC#1.9)
10: parametrboard (LCD#1.19), BordBox (idc34.19 IDC50.10), Ctrl (IDC#1.10)
11: parametrboard (LCD#1.21), BordBox (idc34.21 IDC50.11), Ctrl (IDC#1.11)
12: parametrboard (LCD#1.23), BordBox (idc34.23 IDC50.12), Ctrl (IDC#1.12)
13: parametrboard (LCD#1.25), BordBox (idc34.25 IDC50.13), Ctrl (IDC#1.13)
15: parametrboard (LCD#1.29), BordBox (idc34.29 IDC50.15), Ctrl (IDC#1.15)
16: parametrboard (LCD#1.31), BordBox (idc34.31 IDC50.16), Ctrl (IDC#1.16)
17: parametrboard (LCD#1.33), BordBox (idc34.33 IDC50.17), Ctrl (IDC#1.17)
18: parametrboard (LCD#1.02), BordBox (idc34.2 IDC50.18), Ctrl (IDC#1.18)
19: parametrboard (LCD#1.04), BordBox (idc34.4 IDC50.19), Ctrl (IDC#1.19)
20: parametrboard (LCD#1.06), BordBox (idc34.6 IDC50.20), Ctrl (IDC#1.20)
21: parametrboard (LCD#1.08), BordBox (idc34.8 IDC50.21), Ctrl (IDC#1.21)
22: parametrboard (LCD#1.10), BordBox (idc34.10 IDC50.22), Ctrl (IDC#1.22)
23: parametrboard (LCD#1.12), BordBox (idc34.12 IDC50.23), Ctrl (IDC#1.23)
24: parametrboard (LCD#1.14), BordBox (idc34.14 IDC50.24), Ctrl (IDC#1.24)
25: parametrboard (LCD#1.16), BordBox (idc34.16 IDC50.25), Ctrl (IDC#1.25)
26: parametrboard (LCD#1.18), BordBox (idc34.18 IDC50.26), Ctrl (IDC#1.26)
27: parametrboard (LCD#1.20), BordBox (idc34.20 IDC50.27), Ctrl (IDC#1.27)
28: parametrboard (LCD#1.22), BordBox (idc34.22 IDC50.28), Ctrl (IDC#1.28)
29: parametrboard (LCD#1.24), BordBox (idc34.24 IDC50.29), Ctrl (IDC#1.29)
30: parametrboard (LCD#1.26), BordBox (idc34.26 IDC50.30), Ctrl (IDC#1.30)
31: parametrboard (LCD#1.28), BordBox (idc34.28 IDC50.31), Ctrl (IDC#1.31)
32: parametrboard (LCD#1.30), BordBox (idc34.30 IDC50.32), Ctrl (IDC#1.32)
33: parametrboard (LCD#1.32), BordBox (idc34.32 IDC50.33), Ctrl (IDC#1.33)
34: parametrboard (LCD#1.34), BordBox (idc34.34 IDC50.34), Ctrl (IDC#1.34)
35: parametrboard (sw7#1.2), BordBox (IDC50.35 sw7#2.2), Ctrl (8 pins)
36: parametrboard (sw7#1.1), BordBox (IDC50.36 sw7#2.1), Ctrl (8 pins)
37: parametrboard (sw6#1.2), BordBox (IDC50.37 sw6#2.2), Ctrl (8 pins)
38: parametrboard (sw6#1.1), BordBox (IDC50.38 sw6#2.1), Ctrl (8 pins)
39: parametrboard (sw2#1.2), BordBox (IDC50.39 sw2#2.2), Ctrl (8 pins)
40: parametrboard (sw2#1.1), BordBox (IDC50.40 sw2#2.1), Ctrl (8 pins)
41: parametrboard (LCD#2.3), BordBox (Hall.3 IDC50.41), Ctrl (IDC#1.41 J1.01 J1.02)
42: parametrboard (LCD#2.2), BordBox (Hall.2 IDC50.42), Ctrl (IDC#1.42 J1.03 J1.04)
43: parametrboard (LCD#2.1), BordBox (Hall.1 IDC50.43), Ctrl (IDC#1.43 J1.05 J1.06)
45: BordBox (IDC50.14), Ctrl (IDC#1.45)
46: BordBox (IDC50.46), Ctrl (IDC#1.46)
47: BordBox (IDC50.47), Ctrl (IDC#1.47)
48: BordBox (IDC50.48), Ctrl (IDC#1.48)
49: BordBox (IDC50.49), Ctrl (IDC#1.49)
50: BordBox (IDC50.50), Ctrl (IDC#1.50)
GND: parametrboard (LCD#1.27), BordBox (idc34.27 IDC50.45), Ctrl (IDC#1.14)
Vdd: BordBox (IDC50.44), Ctrl (IDC#1.44)